# Altium schematic sheet ip_phone_a_sdram.SchDoc: SDRAM
size A3; SheetNumber: 1; SheetTotal: 6
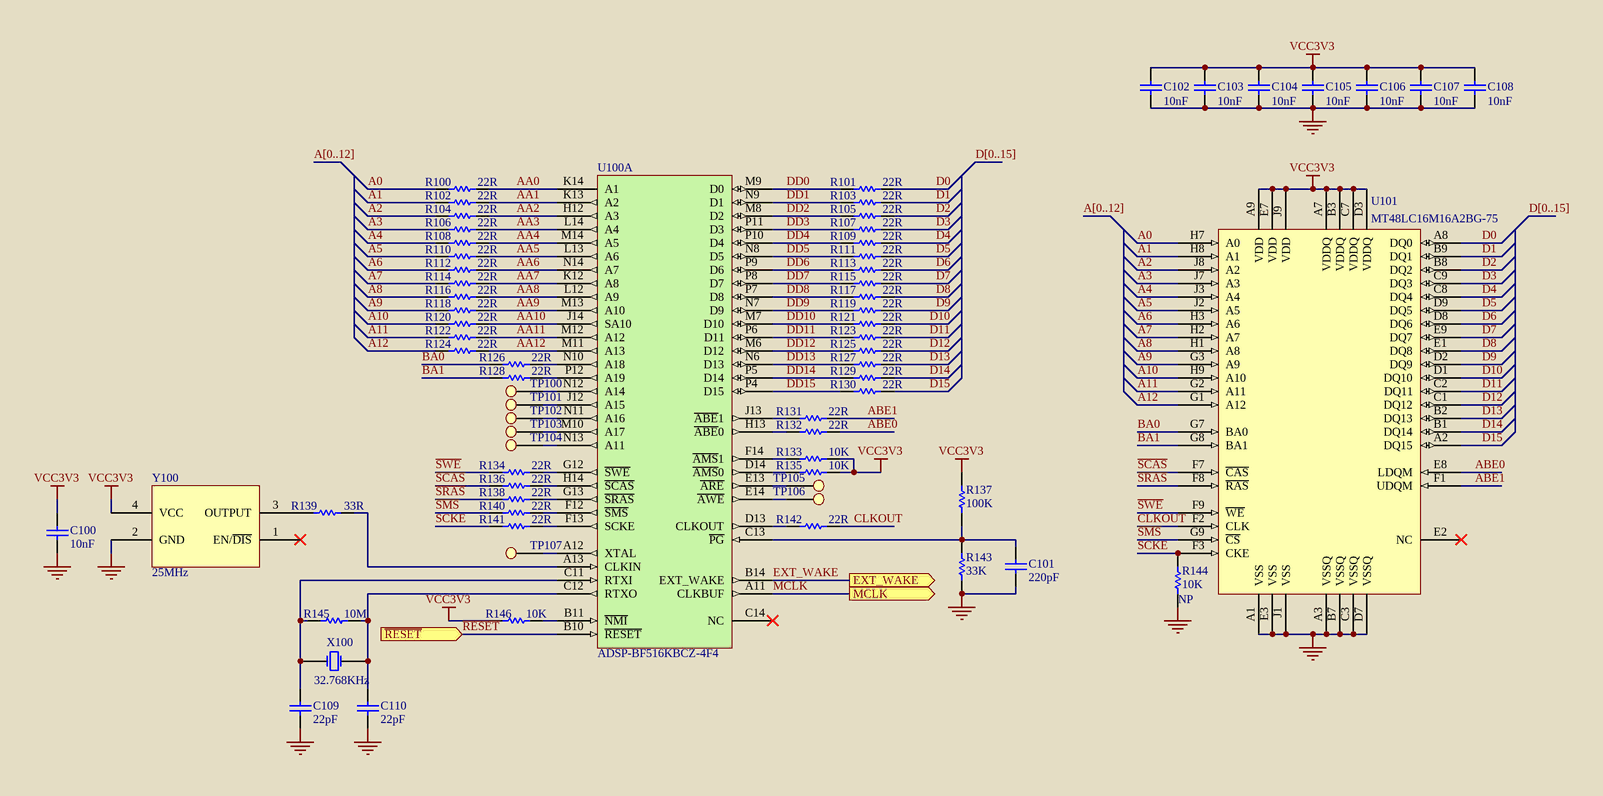
[diagram p0: ip_phone_a_sdram.SchDoc]

## Parts
C100  10nF  [CC1005-0402]
C101  220pF  [CC1005-0402]
C102  10nF  [CC1005-0402]
C103  10nF  [CC1005-0402]
C104  10nF  [CC1005-0402]
C105  10nF  [CC1005-0402]
C106  10nF  [CC1005-0402]
C107  10nF  [CC1005-0402]
C108  10nF  [CC1005-0402]
C109  22pF  [CC1005-0402]
C110  22pF  [CC1005-0402]
R100  22R  [CR1005-0402]
R101  22R  [CR1005-0402]
R102  22R  [CR1005-0402]
R103  22R  [CR1005-0402]
R104  22R  [CR1005-0402]
R105  22R  [CR1005-0402]
R106  22R  [CR1005-0402]
R107  22R  [CR1005-0402]
R108  22R  [CR1005-0402]
R109  22R  [CR1005-0402]
R110  22R  [CR1005-0402]
R111  22R  [CR1005-0402]
R112  22R  [CR1005-0402]
R113  22R  [CR1005-0402]
R114  22R  [CR1005-0402]
R115  22R  [CR1005-0402]
R116  22R  [CR1005-0402]
R117  22R  [CR1005-0402]
R118  22R  [CR1005-0402]
R119  22R  [CR1005-0402]
R120  22R  [CR1005-0402]
R121  22R  [CR1005-0402]
R122  22R  [CR1005-0402]
R123  22R  [CR1005-0402]
R124  22R  [CR1005-0402]
R125  22R  [CR1005-0402]
R126  22R  [CR1005-0402]
R127  22R  [CR1005-0402]
R128  22R  [CR1005-0402]
R129  22R  [CR1005-0402]
R130  22R  [CR1005-0402]
R131  22R  [CR1005-0402]
R132  22R  [CR1005-0402]
R133  10K  [CR1005-0402]
R134  22R  [CR1005-0402]
R135  10K  [CR1005-0402]
R136  22R  [CR1005-0402]
R137  100K  [CR1005-0402]
R138  22R  [CR1005-0402]
R139  33R  [CR1005-0402]
R140  22R  [CR1005-0402]
R141  22R  [CR1005-0402]
R142  22R  [CR1005-0402]
R143  33K  [CR1005-0402]
R144  10K  [CR1005-0402_NP]
R145  10M  [CR1005-0402]
R146  10K  [CR1005-0402]
TP100  Test Point  [Test Point]  (value not drawn)  (no BOM)
TP101  Test Point  [Test Point]  (value not drawn)  (no BOM)
TP102  Test Point  [Test Point]  (value not drawn)  (no BOM)
TP103  Test Point  [Test Point]  (value not drawn)  (no BOM)
TP104  Test Point  [Test Point]  (value not drawn)  (no BOM)
TP105  Test Point  [Test Point]  (value not drawn)  (no BOM)
TP106  Test Point  [Test Point]  (value not drawn)  (no BOM)
TP107  Test Point  [Test Point]  (value not drawn)  (no BOM)
U100  ADSP-BF516KBCZ-4F4  [BGA168]  (part A of 3)
U101  MT48LC16M16A2BG-75  [VFBGA54]
X100  32.768KHz  [XTAL_32.768kHz]
Y100  25MHz  [OSC_25MHz]

## Ports
EXT_WAKE (out), MCLK (out), ~{RESET} (in)

## Nets
GND: C100.1 C101.1 C102.1 C103.1 C104.1 C105.1 C106.1 C107.1 C108.1 C109.1 C110.1 R143.1 R144.1 U101.A1(VSS) U101.A3(VSSQ) U101.B7(VSSQ) U101.C3(VSSQ) U101.D7(VSSQ) U101.E3(VSS) U101.J1(VSS) Y100.2(GND)
VCC3V3: C100.2 C102.2 C103.2 C104.2 C105.2 C106.2 C107.2 C108.2 R133.2 R135.2 R137.2 R146.1 U101.A7(VDDQ) U101.A9(VDD) U101.B3(VDDQ) U101.C7(VDDQ) U101.D3(VDDQ) U101.E7(VDD) U101.J9(VDD) Y100.4(VCC)
~{RESET}: U100.B10(~{RESET}) ; port ~{RESET}
A0: R100.1 U101.H7(A0)
A1: R102.1 U101.H8(A1)
A2: R104.1 U101.J8(A2)
A3: R106.1 U101.J7(A3)
A4: R108.1 U101.J3(A4)
A5: R110.1 U101.J2(A5)
A6: R112.1 U101.H3(A6)
A7: R114.1 U101.H2(A7)
A8: R116.1 U101.H1(A8)
A9: R118.1 U101.G3(A9)
A10: R120.1 U101.H9(A10)
A11: R122.1 U101.G2(A11)
A12: R124.1 U101.G1(A12)
AA0: R100.2 U100.K14(A1)
AA1: R102.2 U100.K13(A2)
AA2: R104.2 U100.H12(A3)
AA3: R106.2 U100.L14(A4)
AA4: R108.2 U100.M14(A5)
AA5: R110.2 U100.L13(A6)
AA6: R112.2 U100.N14(A7)
AA7: R114.2 U100.K12(A8)
AA8: R116.2 U100.L12(A9)
AA9: R118.2 U100.M13(A10)
AA10: R120.2 U100.J14(SA10)
AA11: R122.2 U100.M12(A12)
AA12: R124.2 U100.M11(A13)
ABE0: R132.2 U101.E8(LDQM)
ABE1: R131.2 U101.F1(UDQM)
BA0: R126.1 U101.G7(BA0)
BA1: R128.1 U101.G8(BA1)
CLKOUT: R142.2 U101.F2(CLK)
D0: R101.2 U101.A8(DQ0)
D1: R103.2 U101.B9(DQ1)
D2: R105.2 U101.B8(DQ2)
D3: R107.2 U101.C9(DQ3)
D4: R109.2 U101.C8(DQ4)
D5: R111.2 U101.D9(DQ5)
D6: R113.2 U101.D8(DQ6)
D7: R115.2 U101.E9(DQ7)
D8: R117.2 U101.E1(DQ8)
D9: R119.2 U101.D2(DQ9)
D10: R121.2 U101.D1(DQ10)
D11: R123.2 U101.C2(DQ11)
D12: R125.2 U101.C1(DQ12)
D13: R127.2 U101.B2(DQ13)
D14: R129.2 U101.B1(DQ14)
D15: R130.2 U101.A2(DQ15)
DD0: R101.1 U100.M9(D0)
DD1: R103.1 U100.N9(D1)
DD2: R105.1 U100.M8(D2)
DD3: R107.1 U100.P11(D3)
DD4: R109.1 U100.P10(D4)
DD5: R111.1 U100.N8(D5)
DD6: R113.1 U100.P9(D6)
DD7: R115.1 U100.P8(D7)
DD8: R117.1 U100.P7(D8)
DD9: R119.1 U100.N7(D9)
DD10: R121.1 U100.M7(D10)
DD11: R123.1 U100.P6(D11)
DD12: R125.1 U100.M6(D12)
DD13: R127.1 U100.N6(D13)
DD14: R129.1 U100.P5(D14)
DD15: R130.1 U100.P4(D15)
EXT_WAKE: U100.B14(EXT_WAKE) ; port EXT_WAKE
MCLK: U100.A11(CLKBUF) ; port MCLK
~{SCAS}: R136.1 U101.F7(~{CAS})
~{SMS}: R140.1 U101.G9(~{CS})
~{SRAS}: R138.1 U101.F8(~{RAS})
~{SWE}: R134.1 U101.F9(~{WE})
SCKE: R141.1 R144.2 U101.F3(CKE)
NetC101_2: C101.2 R137.1 R143.2 U100.C13(~{PG})
NetC109_2: C109.2 R145.1 U100.C11(RTXI) X100.1(OSC1)
NetC110_2: C110.2 R145.2 U100.C12(RTXO) X100.4(OSC2)
NetR126_2: R126.2 U100.N10(A18)
NetR128_2: R128.2 U100.P12(A19)
NetR131_1: R131.1 U100.J13(~{ABE}1)
NetR132_1: R132.1 U100.H13(~{ABE}0)
NetR133_1: R133.1 U100.F14(~{AMS}1)
NetR134_2: R134.2 U100.G12(~{SWE})
NetR135_1: R135.1 U100.D14(~{AMS}0)
NetR136_2: R136.2 U100.H14(~{SCAS})
NetR138_2: R138.2 U100.G13(~{SRAS})
NetR139_1: R139.1 Y100.3(OUTPUT)
NetR139_2: R139.2 U100.A13(CLKIN)
NetR140_2: R140.2 U100.F12(~{SMS})
NetR141_2: R141.2 U100.F13(SCKE)
NetR142_1: R142.1 U100.D13(CLKOUT)
NetR146_2: R146.2 U100.B11(~{NMI})
NetTP100_1: TP100.1 U100.N12(A14)
NetTP101_1: TP101.1 U100.J12(A15)
NetTP102_1: TP102.1 U100.N11(A16)
NetTP103_1: TP103.1 U100.M10(A17)
NetTP104_1: TP104.1 U100.N13(A11)
NetTP105_1: TP105.1 U100.E13(~{ARE})
NetTP106_1: TP106.1 U100.E14(~{AWE})
NetTP107_1: TP107.1 U100.A12(XTAL)

Not connected (* = marked no-connect by the designer): U100 C14(NC)*; U101 E2(NC)*; Y100 1(EN/~{DIS})*

## Buses and harness runs
bus A[0..12]
bus D[0..15]

## Notes on the sheet
- Título:
- Universidade Federal do Ceará
- Padrão:
- Projeto:
- A3
- Blackfin IP Phone
- Data:
- Versão:
- Folha:
- V1
- de
- Centro de Tecnologia
- Dep. de Eng. de Teleinformática
- Fortaleza - Ceará - Brasil
- Arquivo:

## Library data of the parts
C100 = Capacitor: Ceramic Capacitor 10nF 50V X7R 0402; eVendorPart#: 810-C1005X7R1C103K; Manufacturer: TDK; Part#: C1005X7R1C103KT; eVendor: Mouser; eVendorPrice: 0,03; MSRP: 0,004; MOQ: 1000
C101 = Capacitor: eVendorPart#: 311-1035-1-ND; Manufacturer: Yageo; Part#: CC0402KRX7R9BB221; eVendor: Digikey; eVendorPrice: 0,015; MSRP: 0,00335; MOQ: 1000
C102-C108 = Capacitor: Ceramic Capacitor 0.01uF 50V X7R 0402; eVendorPart#: 810-C1005X7R1C103K; Manufacturer: TDK; Part#: C1005X7R1C103KT; eVendor: Mouser; eVendorPrice: 0,03; MSRP: 0,004; MOQ: 1000
C109 C110 = Capacitor: Ceramic Capacitor 22pF 50V 5% C0G 0402; eVendorPart#: 490-1283-1-ND; Manufacturer: Murata Electronics North America; Part#: GRM1555C1H220JZ01D; eVendor: Digikey; eVendorPrice: 0,028; MSRP: 0,00614; MOQ: 1000
R100-R132 R134 R136 R138 R140-R142 = Resistor: Thick Film Resistors SMD 0402 22R 5%  1/16 W; eVendorPart#: 71-CRCW0402J-22-E3; Manufacturer: Vishay/Dale; Part#: CRCW040222R0JNED; eVendor: Mouser; eVendorPrice: 0,08; MSRP: 0,015; MOQ: 1000
R133 R135 = Resistor: Thick Film Resistors SMD 0402 10k 5%  1/16 W; eVendorPart#: 311-10KJRCT-ND; Manufacturer: Yageo; Part#: RC0402JR-0710KL; eVendor: Digikey; eVendorPrice: 0,012; MSRP: 0,00253; MOQ: 1000
R137 = Resistor: Thick Film Resistors SMD 0402 100K 5%  1/16 W; eVendorPart#: 311-100KJRCT-ND; Manufacturer: Yageo; Part#: RC0402JR-07100KL; eVendor: Digikey; eVendorPrice: 0,012; MSRP: 0,00253; MOQ: 1000
R139 = Resistor: Thick Film Resistors SMD 0402 33R 5%  1/16 W; eVendorPart#: 311-33JRCT-ND; Manufacturer: Yageo; Part#: RC0402JR-0733RL; eVendor: Digikey; eVendorPrice: 0,012; MSRP: 0,00253; MOQ: 1000
R143 = Resistor: Thick Film Resistors SMD 0402 33K 5%  1/16 W; eVendorPart#: 311-33KJRCT-ND; Manufacturer: Yageo; Part#: RC0402JR-0733KL; eVendor: Digikey; eVendorPrice: 0,012; MSRP: 0,00253; MOQ: 1000
R144 R146 = Resistor: Thick Film Resistors SMD 0402 10K 5%  1/16 W; eVendorPart#: 311-10KJRCT-ND; Manufacturer: Yageo; Part#: RC0402JR-0710KL; eVendor: Digikey; eVendorPrice: 0,012; MSRP: 0,00253; MOQ: 1000
  R144: NP: NP
R145 = Resistor: Thick Film Resistors SMD 0402 10M 5%  1/16 W; eVendorPart#: RMCF0402JT10M0CT-ND; Manufacturer: Stackpole Electronics Inc; Part#: RMCF0402JT10M0; eVendor: Digikey; eVendorPrice: 0,02; MSRP: 0,00256; MOQ: 1000
TP100-TP107 = Test Point: eVendor: NÃO SE APLICA; eVendorPrice: 0,00; eVendorPart#: NÃO SE APLICA; Part#: NÃO SE APLICA; Manufacturer: NÃO SE APLICA; MOQ: 1000; MSRP: 0,00
U100 = ADSP-BF516KBCZ-4F4: Low Power Blackfin with Advanced Embedded Connectivity; Manufacturer: Analog Device; eVendor: Avnet; eVendorPrice: 19,42; MSRP: 14,15; eVendorPart#: ADSP-BF516KBCZ-4F4; MOQ: 500; Part#: ADSP-BF516KBCZ-4F4
U101 = MT48LC16M16A2BG-75: SDRAM 256M-Bit 16Mx16 3.3V 54-Pin VFBGA Tray; eVendorPart#: MT48LC16M16A2BG-75 IT:D; Manufacturer: Micron; eVendor: Avnet; eVendorPrice: 9,23; MSRP: 8,33; MOQ: 100; Part#: MT48LC16M16A2BG-75 IT:D
X100 = XTAL_32.768KHz: Crystal 32.768KHz; eVendorPart#: 732-MC30632.7680KA0R; Part#: MC-306 32.7680K-A0:ROHS; Manufacturer: Epson; eVendor: Mouser; eVendorPrice: 0,95; MSRP: 0,378; MOQ: 1000
Y100 = Oscillator_25MHz: Crystal Clock Oscillator 25MHz  50ppm 3.3V; eVendorPart#: 300-8254-1-ND; Part#: ASFL1-25.000MHZ-EC-T; Manufacturer: ABRACON; eVendor: Digikey; eVendorPrice: 2,55; MSRP: 1,292; MOQ: 1000